# Altium schematic sheet Sheet2.SchDoc
size A
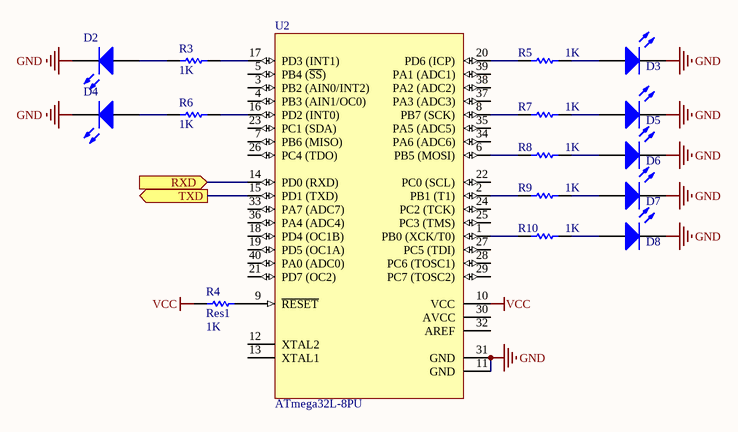
[diagram p0: Sheet2.SchDoc]

## Parts
D2  LED0  [LED-0]  (value not drawn)
D3  LED0  [LED-0]  (value not drawn)
D4  LED0  [LED-0]  (value not drawn)
D5  LED0  [LED-0]  (value not drawn)
D6  LED0  [LED-0]  (value not drawn)
D7  LED0  [LED-0]  (value not drawn)
D8  LED0  [LED-0]  (value not drawn)
R3  value 1K  [AXIAL-0.3]  (hidden comment: Res1)
R4  Res1  value 1K  [AXIAL-0.3]
R5  value 1K  [AXIAL-0.3]  (hidden comment: Res1)
R6  value 1K  [AXIAL-0.3]  (hidden comment: Res1)
R7  value 1K  [AXIAL-0.3]  (hidden comment: Res1)
R8  value 1K  [AXIAL-0.3]  (hidden comment: Res1)
R9  value 1K  [AXIAL-0.3]  (hidden comment: Res1)
R10  value 1K  [AXIAL-0.3]  (hidden comment: Res1)
U2  ATmega32L-8PU  [40P6]

## Ports
RXD (in), TXD (out)

## Nets
GND: D2.2(K) D3.2(K) D4.2(K) D5.2(K) D6.2(K) D7.2(K) D8.2(K) U2.11(GND) U2.31(GND)
VCC: R4.1 U2.10(VCC)
RXD: U2.14(PD0_(RXD)) ; port RXD
TXD: U2.15(PD1_(TXD)) ; port TXD
NetD2_1: D2.1(A) R3.2
NetD3_1: D3.1(A) R5.2
NetD4_1: D4.1(A) R6.2
NetD5_1: D5.1(A) R7.2
NetD6_1: D6.1(A) R8.2
NetD7_1: D7.1(A) R9.2
NetD8_1: D8.1(A) R10.2
NetR3_1: R3.1 U2.17(PD3_(INT1))
NetR4_2: R4.2 U2.9(~{RESET})
NetR5_1: R5.1 U2.20(PD6_(ICP))
NetR6_1: R6.1 U2.16(PD2_(INT0))
NetR7_1: R7.1 U2.8(PB7_(SCK))
NetR8_1: R8.1 U2.6(PB5_(MOSI))
NetR9_1: R9.1 U2.2(PB1_(T1))
NetR10_1: R10.1 U2.1(PB0_(XCK/T0))

Not connected (* = marked no-connect by the designer): U2 3(PB2_(AIN0/INT2)) 4(PB3_(AIN1/OC0)) 5(PB4_(~{SS})) 7(PB6_(MISO)) 12(XTAL2) 13(XTAL1) 18(PD4_(OC1B)) 19(PD5_(OC1A)) 21(PD7_(OC2)) 22(PC0_(SCL)) 23(PC1_(SDA)) 24(PC2_(TCK)) 25(PC3_(TMS)) 26(PC4_(TDO)) 27(PC5_(TDI)) 28(PC6_(TOSC1)) 29(PC7_(TOSC2)) 30(AVCC) 32(AREF) 33(PA7_(ADC7)) 34(PA6_(ADC6)) 35(PA5_(ADC5)) 36(PA4_(ADC4)) 37(PA3_(ADC3)) 38(PA2_(ADC2)) 39(PA1_(ADC1)) 40(PA0_(ADC0))

## Library data of the parts
D2-D8 = LED0: Typical INFRARED GaAs LED; Published: 8-Jun-2000; LatestRevisionDate: 08-Jul-2005; LatestRevisionNote: Mech Layer 1 removed.; PackageReference: LED-0; Publisher: Altium Limited; PackageDescription: LED; 2 Leads
R3-R10 = Res1: Resistor; Published: 8-Jun-2000; LatestRevisionDate: 17-Jul-2002; LatestRevisionNote: Re-released for DXP Platform.; PackageReference: AXIAL-0.3; Publisher: Altium Limited; PackageDescription: Axial Device, Thru-Hole; 2 Leads; 0.3 in Pin Spacing
U2 = ATmega32L-8PU: 8-bit AVR Microcontroller, 2.7-5.5V, 8MHz, 32KB Flash, 1024 Bytes EEPROM, 2KB SRAM, 40-pin PDIP, Industrial Grade (-40°C to 85°C); DatasheetVersion: revQ, Feb-2011; PackageVersion: revB, Sep-2001; PackageReference: 40P6; PackageDescription: 40-lead (0.600"/15.24mm Wide) Plastic Dual Inline Package (PDIP); Code_JEDEC: MS-011-AC; ComponentLink1Description: Manufacturer URL; ComponentLink1URL: http://www.atmel.com/; ComponentLink2Description: ATmega32(L) Datasheet; ComponentLink2URL: http://atmel.com/dyn/resources/prod_documents/doc2503.pdf; ComponentLink3Description: ATmega32(L) Summary; ComponentLink3URL: http://atmel.com/dyn/resources/prod_documents/2503S.pdf